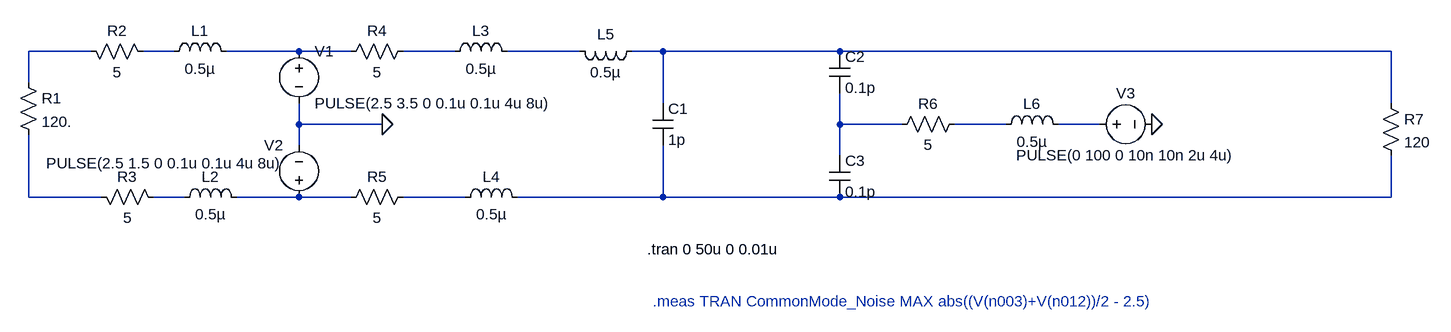
[diagram p0: schematic baseline_model_ps2.asc]
baseline_model_ps2.asc, the LTspice schematic file:
Version 4.1
SHEET 1 2180 680
WIRE 80 -96 -16 -96
WIRE 208 -96 160 -96
WIRE 400 -96 288 -96
WIRE 480 -96 400 -96
WIRE 640 -96 560 -96
WIRE 832 -96 720 -96
WIRE 960 -96 912 -96
WIRE 1232 -96 960 -96
WIRE 2080 -96 1232 -96
WIRE -16 -48 -16 -96
WIRE 960 -16 960 -96
WIRE 2080 -16 2080 -96
WIRE 400 16 400 -16
WIRE 528 16 400 16
WIRE 1232 16 1232 -32
WIRE 1328 16 1232 16
WIRE 1488 16 1408 16
WIRE 1632 16 1568 16
WIRE 400 48 400 16
WIRE 1232 64 1232 16
WIRE -16 128 -16 32
WIRE 96 128 -16 128
WIRE 224 128 176 128
WIRE 400 128 304 128
WIRE 480 128 400 128
WIRE 656 128 560 128
WIRE 960 128 960 48
WIRE 960 128 736 128
WIRE 1232 128 960 128
WIRE 2080 128 2080 64
WIRE 2080 128 1232 128
FLAG 1712 16 0
FLAG 528 16 0
SYMBOL res -32 -64 R0
SYMATTR InstName R1
SYMATTR Value 120.
SYMBOL res 64 -112 M90
WINDOW 0 0 56 VBottom 2
WINDOW 3 32 56 VTop 2
SYMATTR InstName R2
SYMATTR Value 5
SYMBOL res 80 112 M90
WINDOW 0 0 56 VBottom 2
WINDOW 3 32 56 VTop 2
SYMATTR InstName R3
SYMATTR Value 5
SYMBOL ind 304 -80 M270
WINDOW 0 32 56 VTop 2
WINDOW 3 5 56 VBottom 2
SYMATTR InstName L1
SYMATTR Value 0.5µ
SYMATTR SpiceLine Rser=1m
SYMBOL ind 320 144 M270
WINDOW 0 32 56 VTop 2
WINDOW 3 5 56 VBottom 2
SYMATTR InstName L2
SYMATTR Value 0.5µ
SYMATTR SpiceLine Rser=1m
SYMBOL voltage 400 -112 R0
WINDOW 123 0 0 Left 0
WINDOW 39 0 0 Left 0
SYMATTR InstName V1
SYMATTR Value PULSE(2.5 3.5 0 0.1u 0.1u 4u 8u)
SYMBOL voltage 400 144 R180
WINDOW 0 24 96 Left 2
WINDOW 3 24 68 Left 2
WINDOW 123 0 0 Left 0
WINDOW 39 0 0 Left 0
SYMATTR InstName V2
SYMATTR Value PULSE(2.5 1.5 0 0.1u 0.1u 4u 8u)
SYMBOL res 576 -112 R90
WINDOW 0 0 56 VBottom 2
WINDOW 3 32 56 VTop 2
SYMATTR InstName R4
SYMATTR Value 5
SYMBOL res 576 112 R90
WINDOW 0 0 56 VBottom 2
WINDOW 3 32 56 VTop 2
SYMATTR InstName R5
SYMATTR Value 5
SYMBOL ind 624 -80 R270
WINDOW 0 32 56 VTop 2
WINDOW 3 5 56 VBottom 2
SYMATTR InstName L3
SYMATTR Value 0.5µ
SYMATTR SpiceLine Rser=1m
SYMBOL ind 640 144 R270
WINDOW 0 32 56 VTop 2
WINDOW 3 5 56 VBottom 2
SYMATTR InstName L4
SYMATTR Value 0.5µ
SYMATTR SpiceLine Rser=1m
SYMBOL ind 928 -112 R90
WINDOW 0 5 56 VBottom 2
WINDOW 3 32 56 VTop 2
SYMATTR InstName L5
SYMATTR Value 0.5µ
SYMATTR SpiceLine Rser=1m
SYMBOL cap 944 -16 R0
SYMATTR InstName C1
SYMATTR Value 1p
SYMBOL cap 1216 -96 R0
SYMATTR InstName C2
SYMATTR Value 0.1p
SYMBOL cap 1216 64 R0
SYMATTR InstName C3
SYMATTR Value 0.1p
SYMBOL res 1424 0 R90
WINDOW 0 0 56 VBottom 2
WINDOW 3 32 56 VTop 2
SYMATTR InstName R6
SYMATTR Value 5
SYMBOL res 2064 -32 R0
SYMATTR InstName R7
SYMATTR Value 120
SYMBOL voltage 1616 16 R270
WINDOW 0 32 56 VTop 2
WINDOW 3 -32 56 VBottom 2
WINDOW 123 0 0 Left 0
WINDOW 39 0 0 Left 0
SYMATTR InstName V3
SYMATTR Value PULSE(0 100 0 10n 10n 2u 4u)
SYMBOL ind 1472 32 R270
WINDOW 0 32 56 VTop 2
WINDOW 3 5 56 VBottom 2
SYMATTR InstName L6
SYMATTR Value 0.5µ
SYMATTR SpiceLine Rser=1m
TEXT 936 208 Left 2 !.tran 0 50u 0 0.01u
TEXT 944 288 Left 2 ;.meas TRAN CommonMode_Noise MAX abs((V(n003)+V(n012))/2 - 2.5)

The netlist it stands for:
* baseline_model_ps2.asc
R1 N001 N010 120.
R2 N001 N002 5
R3 N010 N011 5
L1 N003 N002 0.5µ Rser=1m
L2 N012 N011 0.5µ Rser=1m
V1 N003 0 PULSE(2.5 3.5 0 0.1u 0.1u 4u 8u)
V2 N012 0 PULSE(2.5 1.5 0 0.1u 0.1u 4u 8u)
R4 N004 N003 5
R5 N013 N012 5
L3 N004 N005 0.5µ Rser=1m
L4 N013 N014 0.5µ Rser=1m
L5 N006 N005 0.5µ Rser=1m
C1 N006 N014 1p
C2 N006 N007 0.1p
C3 N007 N014 0.1p
R6 N008 N007 5
R7 N006 N014 120
V3 N009 0 PULSE(0 100 0 10n 10n 2u 4u)
L6 N008 N009 0.5µ Rser=1m
.tran 0 50u 0 0.01u
* .meas TRAN CommonMode_Noise MAX abs((V(n003)+V(n012))/2 - 2.5)
.backanno
.end